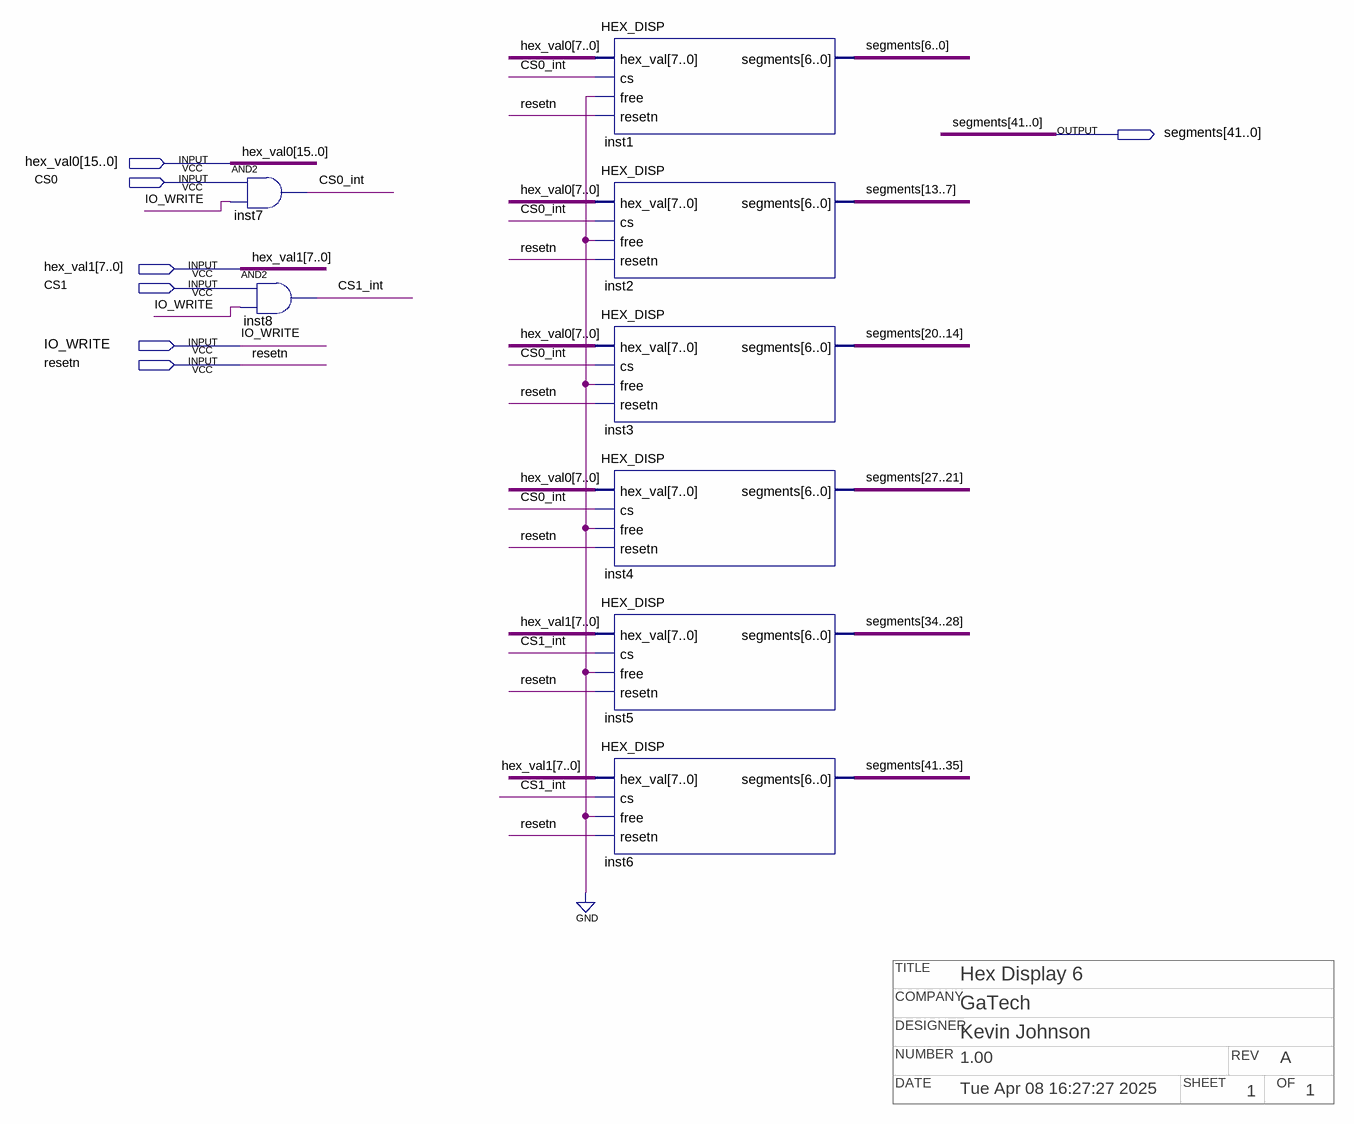
[diagram p0: schematic sheet]
// Quartus schematic HEX_DISP_6.bdf as structural Verilog: 8 symbols, 7 pins
// Title block: COMPANY: GaTech; DATE: Tue Apr 08 16:27:27 2025; DESIGNER: Kevin Johnson; NUMBER: 1.00; OF: 1; REV: A; SHEET: 1; TITLE: Hex Display 6
module HEX_DISP_6 (
  input  [15:0] hex_val0,
  input  CS0,
  input  [7:0] hex_val1,
  input  CS1,
  input  IO_WRITE,
  input  resetn,
  output [41:0] segments
);

  wire CS0_int, CS1_int;

  and inst7 (CS0_int, CS0, IO_WRITE);
  and inst8 (CS1_int, CS1, IO_WRITE);
  HEX_DISP inst1 (.hex_val(hex_val0[7:0]), .cs(CS0_int), .free(1'b0), .resetn(resetn), .segments(segments[6:0]));
  HEX_DISP inst2 (.hex_val(hex_val0[7:0]), .cs(CS0_int), .free(1'b0), .resetn(resetn), .segments(segments[13:7]));
  HEX_DISP inst3 (.hex_val(hex_val0[7:0]), .cs(CS0_int), .free(1'b0), .resetn(resetn), .segments(segments[20:14]));
  HEX_DISP inst4 (.hex_val(hex_val0[7:0]), .cs(CS0_int), .free(1'b0), .resetn(resetn), .segments(segments[27:21]));
  HEX_DISP inst5 (.hex_val(hex_val1), .cs(CS1_int), .free(1'b0), .resetn(resetn), .segments(segments[34:28]));
  HEX_DISP inst6 (.hex_val(hex_val1), .cs(CS1_int), .free(1'b0), .resetn(resetn), .segments(segments[41:35]));
endmodule
